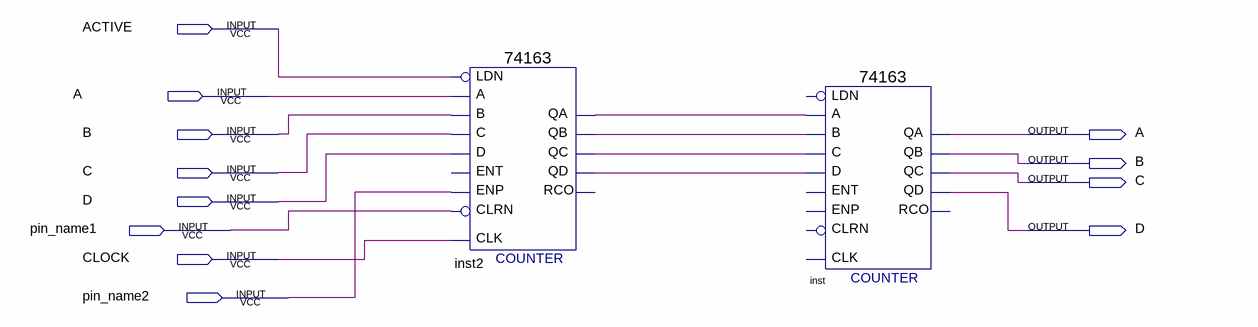
[diagram p0: schematic sheet]
// Quartus schematic SpecialCount.bdf as structural Verilog: 2 symbols, 12 pins
module SpecialCount (
  input  ACTIVE,
  inout  A,
  inout  B,
  inout  C,
  inout  D,
  input  pin_name1,
  input  CLOCK,
  input  pin_name2
);

  wire inst2_qa, inst2_qb, inst2_qc, inst2_qd;

  \74163  inst2 (
    .C(C), .B(B), .A(A), .D(D), .CLRN(pin_name1), .CLK(CLOCK), .ENP(pin_name2), .LDN(ACTIVE), .QA(inst2_qa),
    .QB(inst2_qb), .QC(inst2_qc), .QD(inst2_qd));  // open: ENT, RCO
  \74163  inst (
    .C(inst2_qc), .B(inst2_qb), .A(inst2_qa), .D(inst2_qd), .QA(A), .QB(B), .QC(C), .QD(D));  // open: ENT, CLRN, CLK, ENP, LDN, RCO
endmodule
